# Altium project Placa potência rev. C.PrjPcb
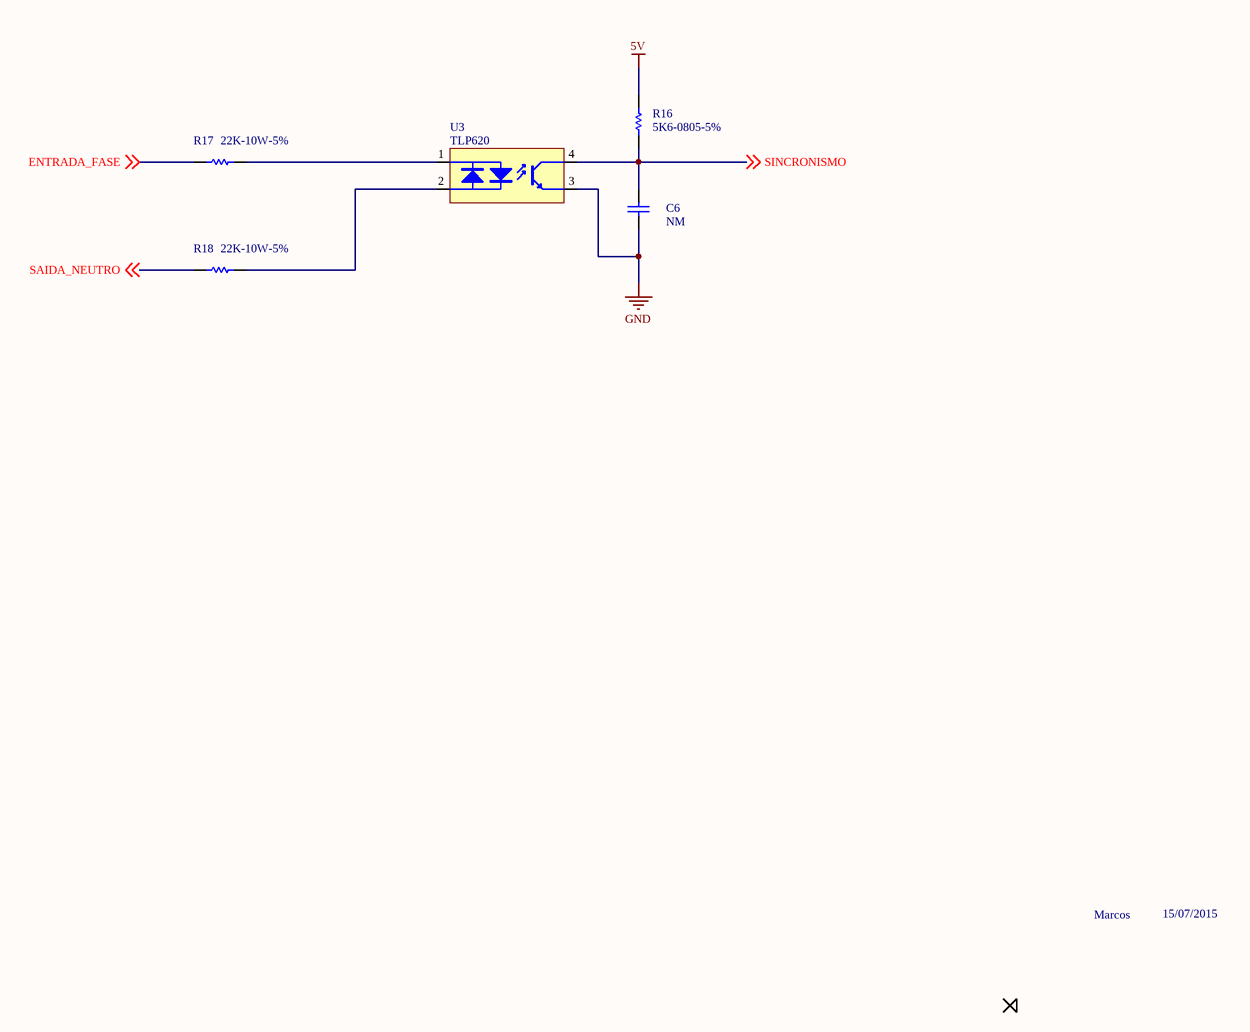
[diagram p0: Sincronismo.SchDoc]
4 sheets, 51 parts. Net scope: global (net labels, ports and power ports of the same name join across sheets).
Board files: PowerBoard.PcbDoc, pICK.PcbDoc
Sheets:
  Sincronismo.SchDoc
  Conectores.SchDoc
  Potencia.SchDoc
  Regulador.SchDoc

## Sheet Sincronismo.SchDoc: PLACA POTÊNCIA REVISÃO C
size A3; DocumentNumber: GA0049; SheetNumber: 1; SheetTotal: 4; PageSetup: Record=PageOptions|CenterHorizontal=True|CenterVertical=True|PrintScale=0.71|XCorrection=1.00|YCorrection=1.00|PrintKind=0|BorderSize=5000000|LeftOffset=0|BottomOffset=0|Orientation=2|PaperLength=1000|PaperWidth=1000|Scale=100|PaperSource=7|PrintQuality=-3|MediaType=1|DitherType=10|PrintScaleMode=1|PaperKind=A4|PaperIndex=9

### Parts
C6  NM  [0805-REVISADO ONDA]
R16  5K6-0805-5%  [0805-REVISADO ONDA]
R17  22K-10W-5%  [RESISTOR 10W CERAMICO]
R18  22K-10W-5%  [RESISTOR 10W CERAMICO]
U3  TLP620  [DIP-4]

### Nets
5V: R16.2
GND: C6.1 U3.3(E)
ENTRADA_FASE: R17.1 ; off-sheet ENTRADA_FASE
SAIDA_NEUTRO: R18.1 ; off-sheet SAIDA_NEUTRO  [project net NEUTRO_GERAL]
SINCRONISMO: C6.2 R16.1 U3.4(C) ; off-sheet SINCRONISMO
NetR17_2: R17.2 U3.1(A)
NetR18_2: R18.2 U3.2(K)

### Notes on the sheet
- Marcos
- 15/07/2015
- NOME
- DATA
- PROJETO
- DESCRIÇÃO
- www.quarktee.com.br
- desenho
- verif.
- aprov.
- TAMANHO
- CODIGO
- Todas as informações disponíveis
- não devem ser divulgadas,
- em parte ou todo.
- CIRCUITO IMPRESSO
- MONTAGEM ELETRÔNICA
- A4
- de

### Library data of the parts
C6 = 100nF/50-0805-NPO: ERP: 104.11.005
R16-R18 = 22K-0805-5%: ERP: 102.11.058
U3 = PC814

## Sheet Conectores.SchDoc: PLACA POTÊNCIA REVISÃO C
size A3; DocumentNumber: GA0049; SheetNumber: 2; SheetTotal: 4
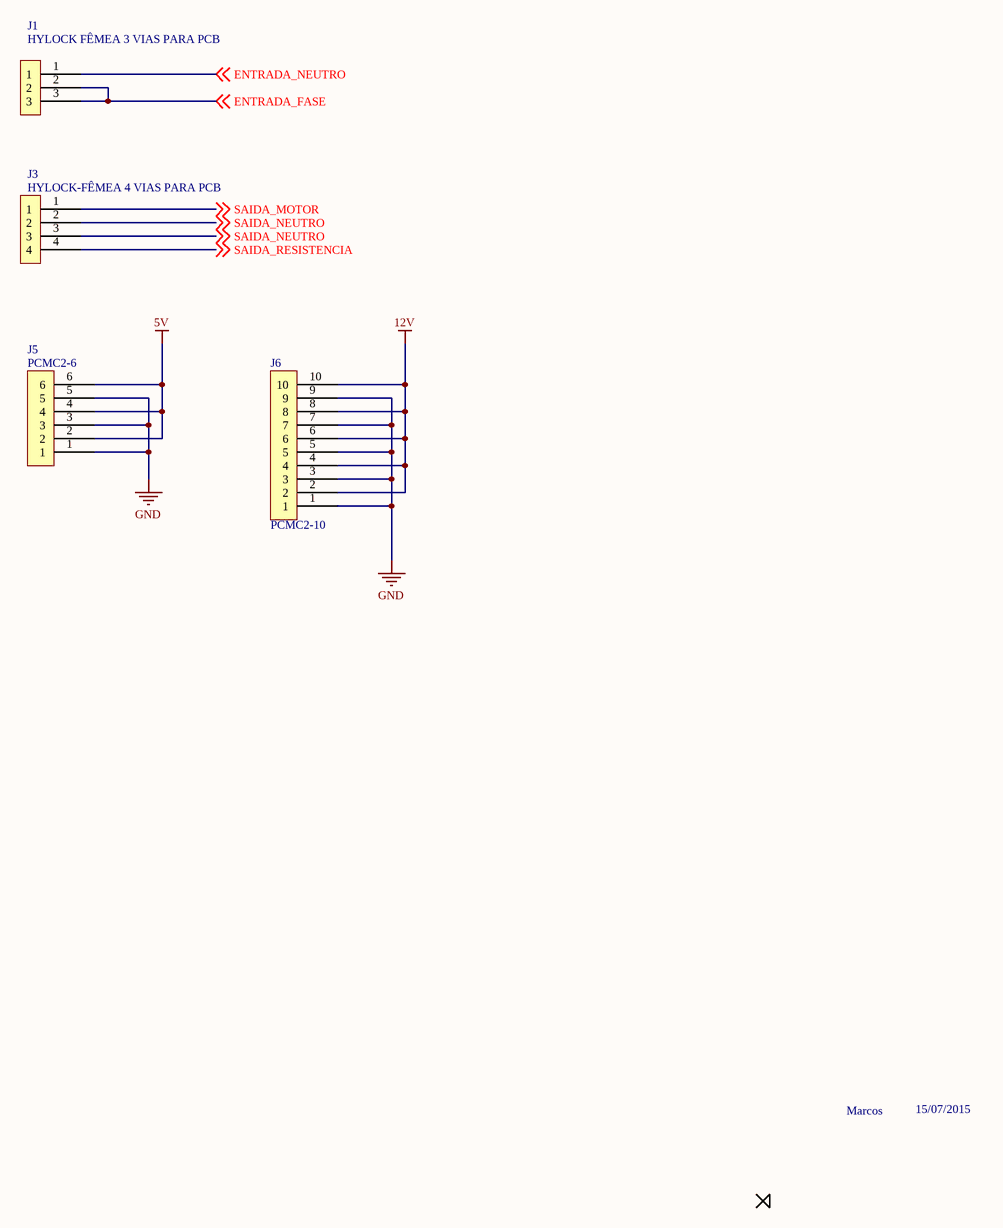
[diagram p1: Conectores.SchDoc]

### Parts
J1  HYLOCK FÊMEA 3 VIAS PARA PCB  [CONECTOR HYLOCK 3 VIAS]
J3  HYLOCK-FÊMEA 4 VIAS PARA PCB  [CONECTOR HYLOK 4 VIAS]
J5  PCMC2-6  [PCMC2-6]
J6  PCMC2-10  [PCMC2-10]

### Nets
5V: J5.2 J5.4 J5.6
12V: J6.2 J6.4 J6.6 J6.8 J6.10
GND: J5.1 J5.3 J5.5 J6.1 J6.3 J6.5 J6.7 J6.9
ENTRADA_FASE: J1.2 J1.3 ; off-sheet ENTRADA_FASE
ENTRADA_NEUTRO: J1.1 ; off-sheet ENTRADA_NEUTRO  [project net NEUTRO]
SAIDA_MOTOR: J3.1 ; off-sheet SAIDA_MOTOR
SAIDA_NEUTRO: J3.2 J3.3 ; off-sheet SAIDA_NEUTRO  [project net NEUTRO_GERAL]
SAIDA_RESISTENCIA: J3.4 ; off-sheet SAIDA_RESISTENCIA

### Notes on the sheet
- Marcos
- 15/07/2015
- NOME
- DATA
- PROJETO
- DESCRIÇÃO
- www.quarktee.com.br
- desenho
- verif.
- aprov.
- TAMANHO
- CODIGO
- Todas as informações disponíveis
- não devem ser divulgadas,
- em parte ou todo.
- CIRCUITO IMPRESSO
- MONTAGEM ELETRÔNICA
- A4
- de

### Library data of the parts
J1 = PCMC2-3
J3 = PCMC2-4

## Sheet Potencia.SchDoc: PLACA POTÊNCIA REVISÃO C
size A3; DocumentNumber: GA0049; SheetNumber: 3; SheetTotal: 4
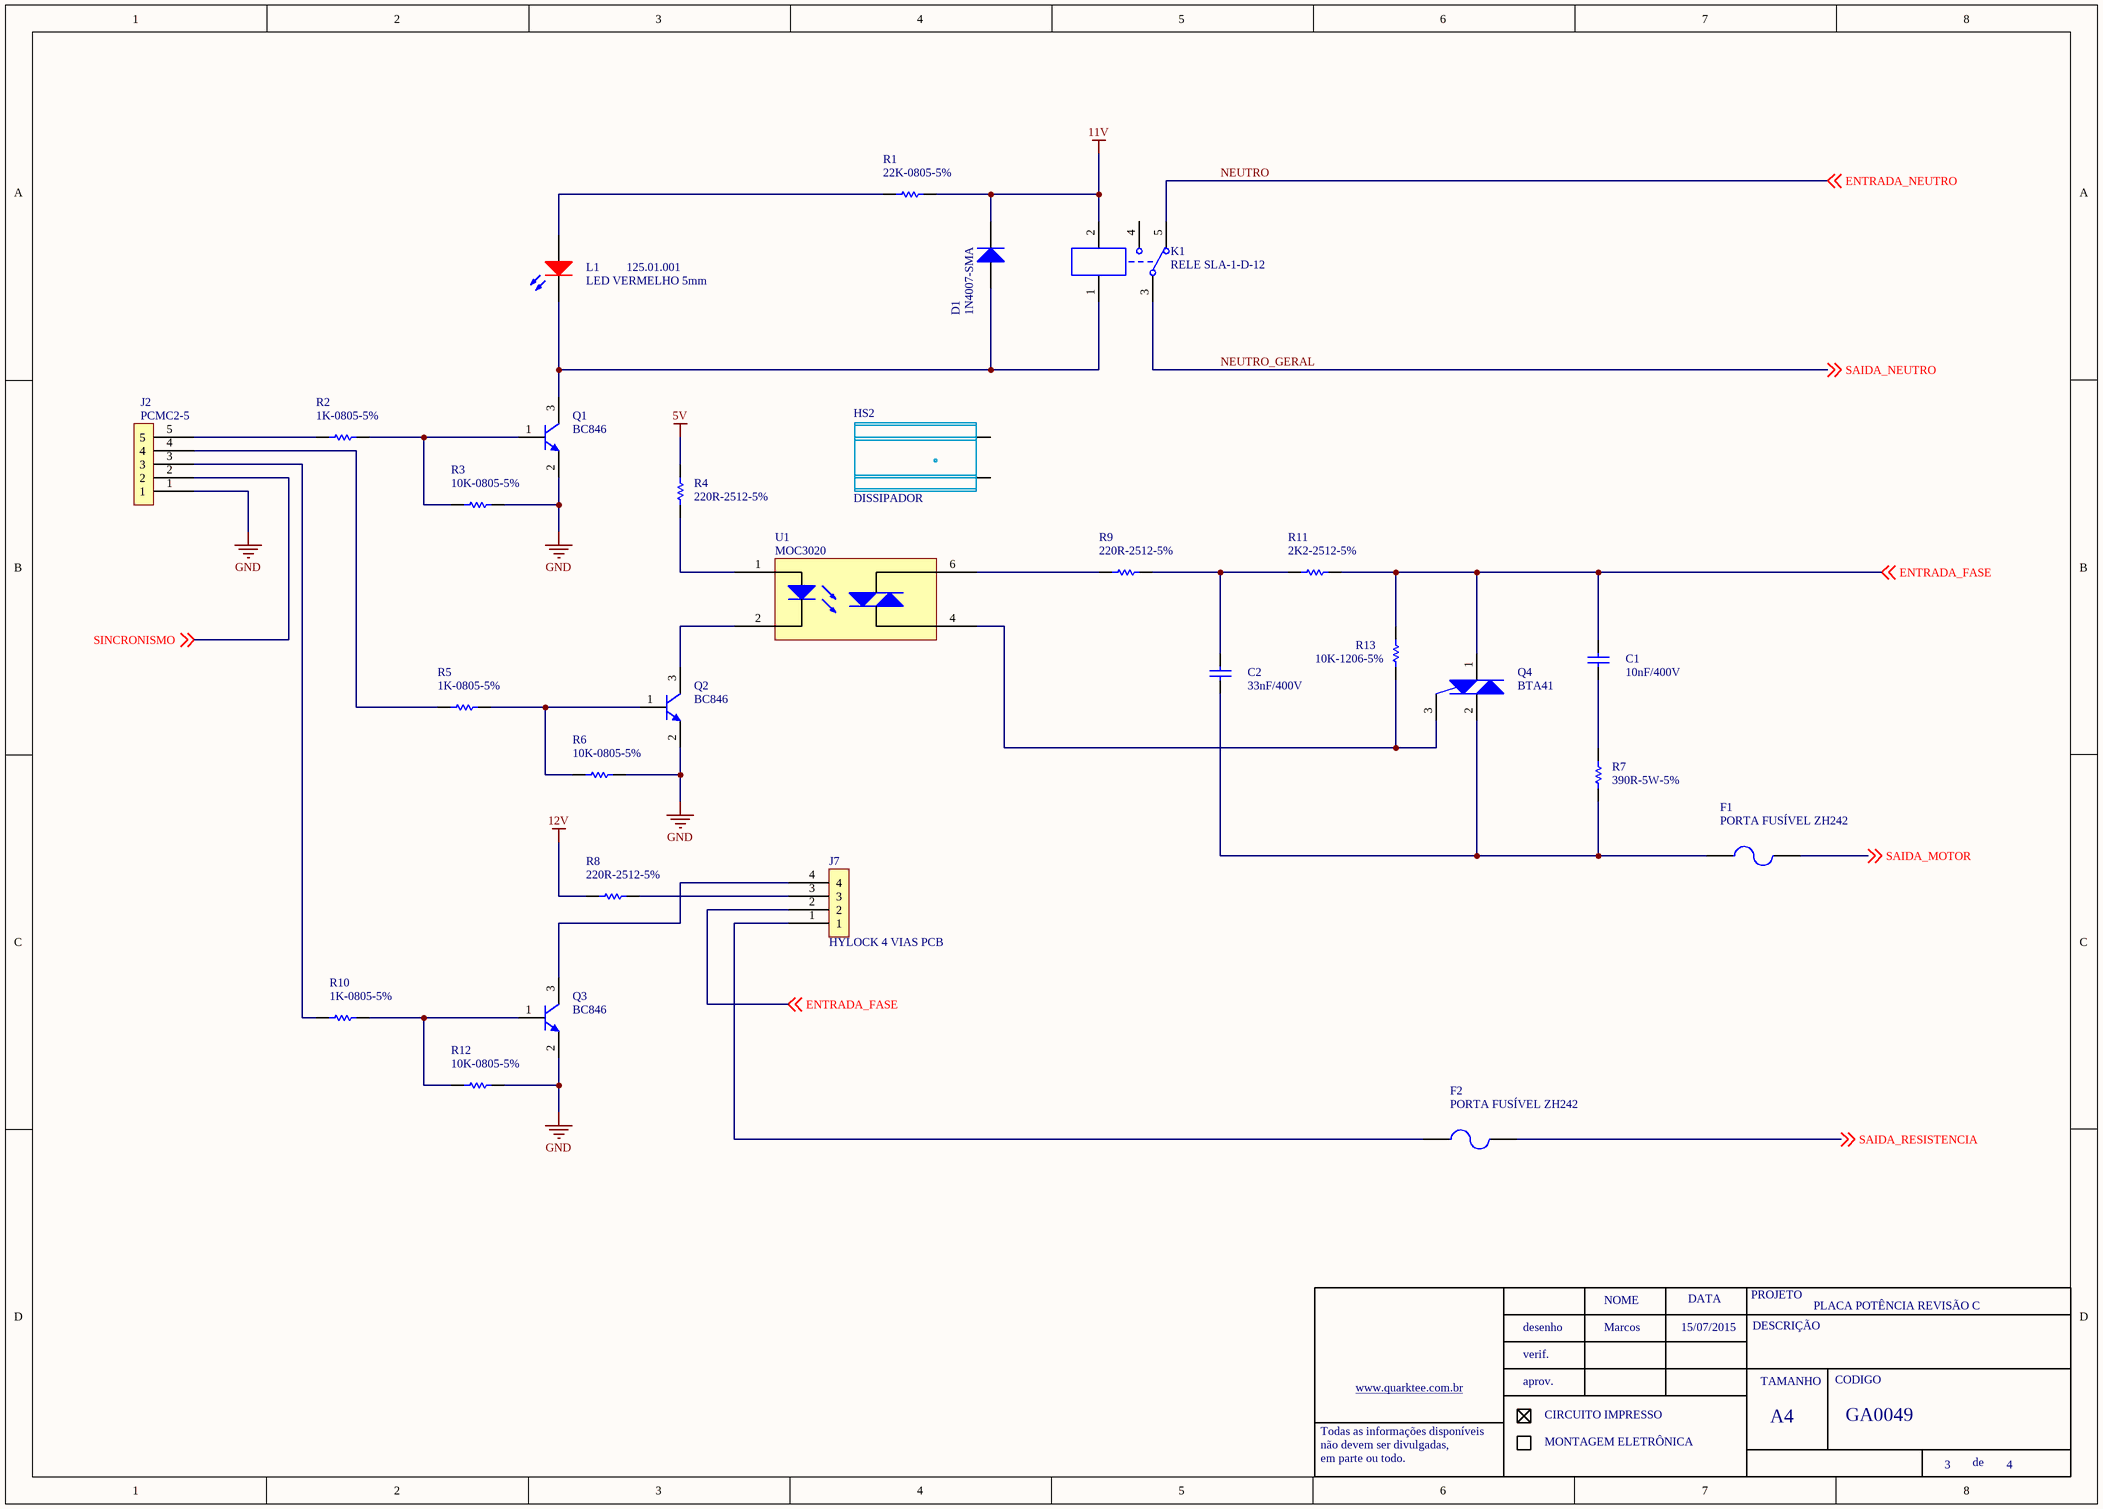
[diagram p2: Potencia.SchDoc]

### Parts
C1  10nF/400V  [cap 330nF/250V]
C2  33nF/400V  [cap 330nF/250V]
D1  1N4007-SMA  [SMA DIODES]
F1  PORTA FUSÍVEL ZH242  [ZH242_REVISADO]
F2  PORTA FUSÍVEL ZH242  [ZH242_REVISADO]
HS2  DISSIPADOR
J2  PCMC2-5  [PCMC2-5]
J7  HYLOCK 4 VIAS PCB  [CONECTOR HYLOK 4 VIAS]
K1  RELE SLA-1-D-12  [rele gigante]
L1  LED VERMELHO 5mm  ERP: 125.01.001  [LED 1206]
Q1  BC846  [SOT23 - REVISADO ONDA]
Q2  BC846  [SOT23 - REVISADO ONDA]
Q3  BC846  [SOT23 - REVISADO ONDA]
Q4  BTA41  [TO-247 - duplicate]
R1  22K-0805-5%  [0805-REVISADO ONDA]
R2  1K-0805-5%  [0805-REVISADO ONDA]
R3  10K-0805-5%  [0805-REVISADO ONDA]
R4  220R-2512-5%  [2512 - REVISADO ONDA]
R5  1K-0805-5%  [0805-REVISADO ONDA]
R6  10K-0805-5%  [0805-REVISADO ONDA]
R7  390R-5W-5%  [RESISTOR 5W FIO]
R8  220R-2512-5%  [2512 - REVISADO ONDA]
R9  220R-2512-5%  [2512 - REVISADO ONDA]
R10  1K-0805-5%  [0805-REVISADO ONDA]
R11  2K2-2512-5%  [2512 - REVISADO ONDA]
R12  10K-0805-5%  [0805-REVISADO ONDA]
R13  10K-1206-5%  [1206-REVISADO ONDA]
U1  MOC3020  [dip6]

### Nets
5V: R4.1
11V: D1.2(K) K1.2 R1.1
12V: R8.2
GND: J2.1 Q1.2(E) Q2.2(E) Q3.2(E) R3.2 R6.2 R12.2
ENTRADA_FASE: C1.2 J7.2 Q4.1(MT1) R11.2 R13.2 ; off-sheet ENTRADA_FASE
NEUTRO: K1.5 ; off-sheet ENTRADA_NEUTRO  [also labelled ENTRADA_NEUTRO]
NEUTRO_GERAL: K1.3 ; off-sheet SAIDA_NEUTRO  [also labelled SAIDA_NEUTRO]
SAIDA_MOTOR: F1.1 ; off-sheet SAIDA_MOTOR
SAIDA_RESISTENCIA: F2.1 ; off-sheet SAIDA_RESISTENCIA
SINCRONISMO: J2.2 ; off-sheet SINCRONISMO
NetC1_1: C1.1 R7.1
NetC2_1: C2.1 F1.2 Q4.2(MT2) R7.2
NetC2_2: C2.2 R9.2 R11.1
NetD1_1: D1.1(A) K1.1 L1.2(K) Q1.3(C)
NetF2_2: F2.2 J7.1
NetJ2_3: J2.3 R10.1
NetJ2_4: J2.4 R5.1
NetJ2_5: J2.5 R2.1
NetJ7_3: J7.3 R8.1
NetJ7_4: J7.4 Q3.3(C)
NetL1_1: L1.1(A) R1.2
NetQ1_1: Q1.1(B) R2.2 R3.1
NetQ2_1: Q2.1(B) R5.2 R6.1
NetQ2_3: Q2.3(C) U1.2
NetQ3_1: Q3.1(B) R10.2 R12.1
NetQ4_3: Q4.3(GATE) R13.1 U1.4
NetR4_2: R4.2 U1.1
NetR9_1: R9.1 U1.6

Not connected (* = marked no-connect by the designer): HS2 0 1; K1 4

### Notes on the sheet
- Marcos
- 15/07/2015
- NOME
- DATA
- PROJETO
- DESCRIÇÃO
- www.quarktee.com.br
- desenho
- verif.
- aprov.
- TAMANHO
- CODIGO
- Todas as informações disponíveis
- não devem ser divulgadas,
- em parte ou todo.
- CIRCUITO IMPRESSO
- MONTAGEM ELETRÔNICA
- A4
- de

### Library data of the parts
C1 C2 = 100nF/50-0805-NPO: ERP: 104.11.005
D1 = 1N4007: ERP: 120.18.001
F1 F2 = PORTA FUSÍVEL TIPO BERÇO: ERP: 426.00.002
HS2 = DISSIPADOR 40mm PÉ
J7 = PCMC2-4
K1 = AT1RC2: ERP: 203.00.005
Q1-Q3 = BC846: BC846L; ERP: 106.22.001
Q4 = BT134-TO220: BT134
R1 R11 R13 = 220R-2512-5%: ERP: 102.31.000
R2 R5 R10 = 10K-0805-5%: ERP: 102.11.054
R7 = 47R-5W-5%: ERP: 103.16.005
R3 R6 R12 = 10K-0805-5%: ERP: 102.11.054
R4 R8 R9 = 220R-2512-5%: ERP: 102.31.000

## Sheet Regulador.SchDoc: PLACA POTÊNCIA REVISÃO C
size A3; DocumentNumber: GA0049; SheetNumber: 4; SheetTotal: 4
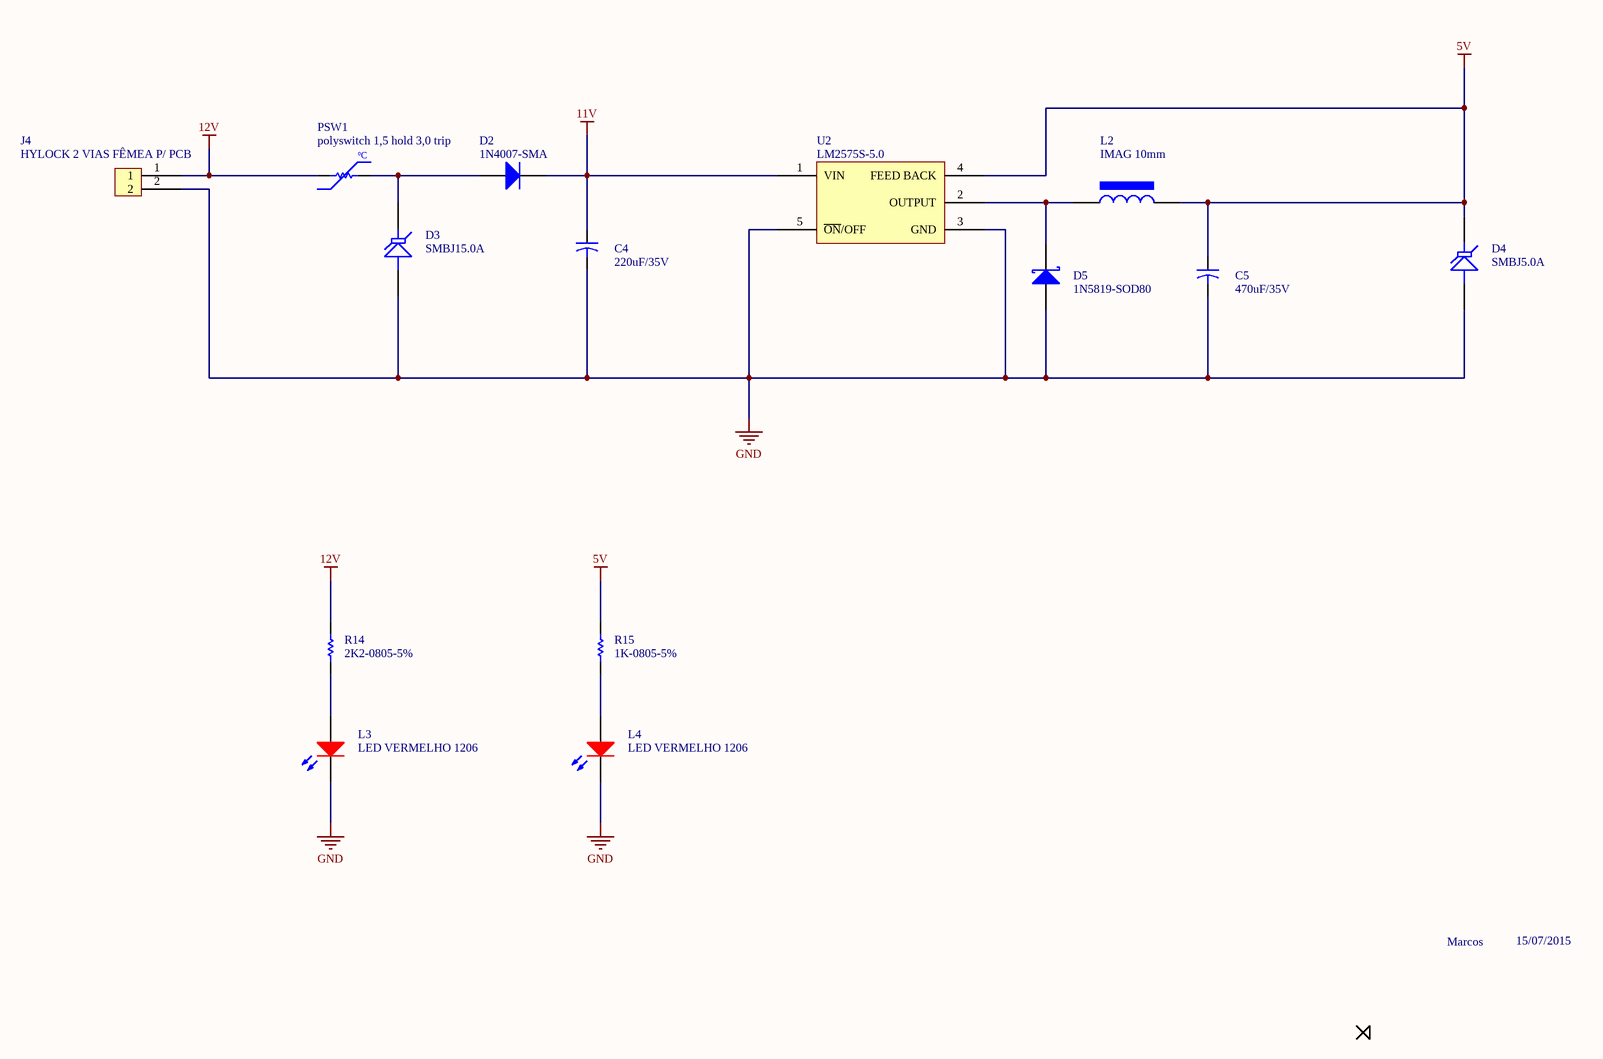
[diagram p3: Regulador.SchDoc]

### Parts
C4  220uF/35V  [CAP POL 8x12mm]
C5  470uF/35V  [CAP POL 8x12mm]
D2  1N4007-SMA  [SMA DIODES]
D3  SMBJ15.0A  [SMA DIODES]
D4  SMBJ5.0A  [SMA DIODES]
D5  1N5819-SOD80  [SMA DIODES]
J4  HYLOCK 2 VIAS FÊMEA P/ PCB  [CONECTOR HYLOCK 2 VIAS]
L2  IMAG 10mm  [INDUTOR 47mH]
L3  LED VERMELHO 1206  [LED 1206]
L4  LED VERMELHO 1206  [LED 1206]
PSW1  polyswitch 1,5 hold 3,0 trip  [1206-REVISADO ONDA]
R14  2K2-0805-5%  [0805-REVISADO ONDA]
R15  1K-0805-5%  [0805-REVISADO ONDA]
U2  LM2575S-5.0  [TO-263-5]

### Nets
5V: C5.1 D4.2(K) L2.1 R15.2 U2.4(FEED_BACK)
11V: C4.1 D2.2(K) U2.1(VIN)
12V: J4.1 PSW1.1 R14.2
GND: C4.2 C5.2 D3.1(A) D4.1(A) D5.1(A) J4.2 L3.2(K) L4.2(K) U2.3(GND) U2.5(~{ON}/OFF)
NetD2_1: D2.1(A) D3.2(K) PSW1.2
NetD5_2: D5.2(K) L2.2 U2.2(OUTPUT)
NetL3_1: L3.1(A) R14.1
NetL4_1: L4.1(A) R15.1

### Notes on the sheet
- Marcos
- 15/07/2015
- NOME
- DATA
- PROJETO
- DESCRIÇÃO
- www.quarktee.com.br
- desenho
- verif.
- aprov.
- TAMANHO
- CODIGO
- Todas as informações disponíveis
- não devem ser divulgadas,
- em parte ou todo.
- CIRCUITO IMPRESSO
- MONTAGEM ELETRÔNICA
- A4
- de
- (in symbol POLYSWITCH 200mA) ºC

### Library data of the parts
C4 = 2200uF/50V: ERP: 105.01.008
C5 = 470uF/50V: ERP: 105.01.005
D2 = 1N4007: ERP: 120.18.001
D3 = SMBJ30.0A: ERP: 128.02.003
J4 = PCMC2-2
L2 = indutor 1mH CNF15: 1mH-CNF15-26 AWG; ERP: 211.00.012
L3 L4 = LED VERMELHO 5mm: ERP: 125.01.001
PSW1 = POLYSWITCH 200mA: NANOSMDC020F-2; ERP: 128.12.002
R14 = 1K-0805-5%: ERP: 102.11.042
U2 = LM2596S-ADJ
D4 = SMBJ5.0A: ERP: 128.02.002
D5 = 1N5819-SOD80: ERP: 121.18.003
R15 = 1K-0805-5%: ERP: 102.11.042

## Nets that join several sheets
5V: Sincronismo (R16.2), Conectores (J5.2 J5.4 J5.6), Potencia (R4.1), Regulador (5 pins)
11V: Potencia (D1.2 K1.2 R1.1), Regulador (C4.1 D2.2 U2.1)
12V: Conectores (5 pins), Potencia (R8.2), Regulador (J4.1 PSW1.1 R14.2)
GND: Sincronismo (C6.1 U3.3), Conectores (8 pins), Potencia (7 pins), Regulador (10 pins)
ENTRADA_FASE: Sincronismo (R17.1), Conectores (J1.2 J1.3), Potencia (5 pins)
NEUTRO: Conectores (J1.1), Potencia (K1.5)
NEUTRO_GERAL: Sincronismo (R18.1), Conectores (J3.2 J3.3), Potencia (K1.3)
SAIDA_MOTOR: Conectores (J3.1), Potencia (F1.1)
SAIDA_RESISTENCIA: Conectores (J3.4), Potencia (F2.1)
SINCRONISMO: Sincronismo (C6.2 R16.1 U3.4), Potencia (J2.2)